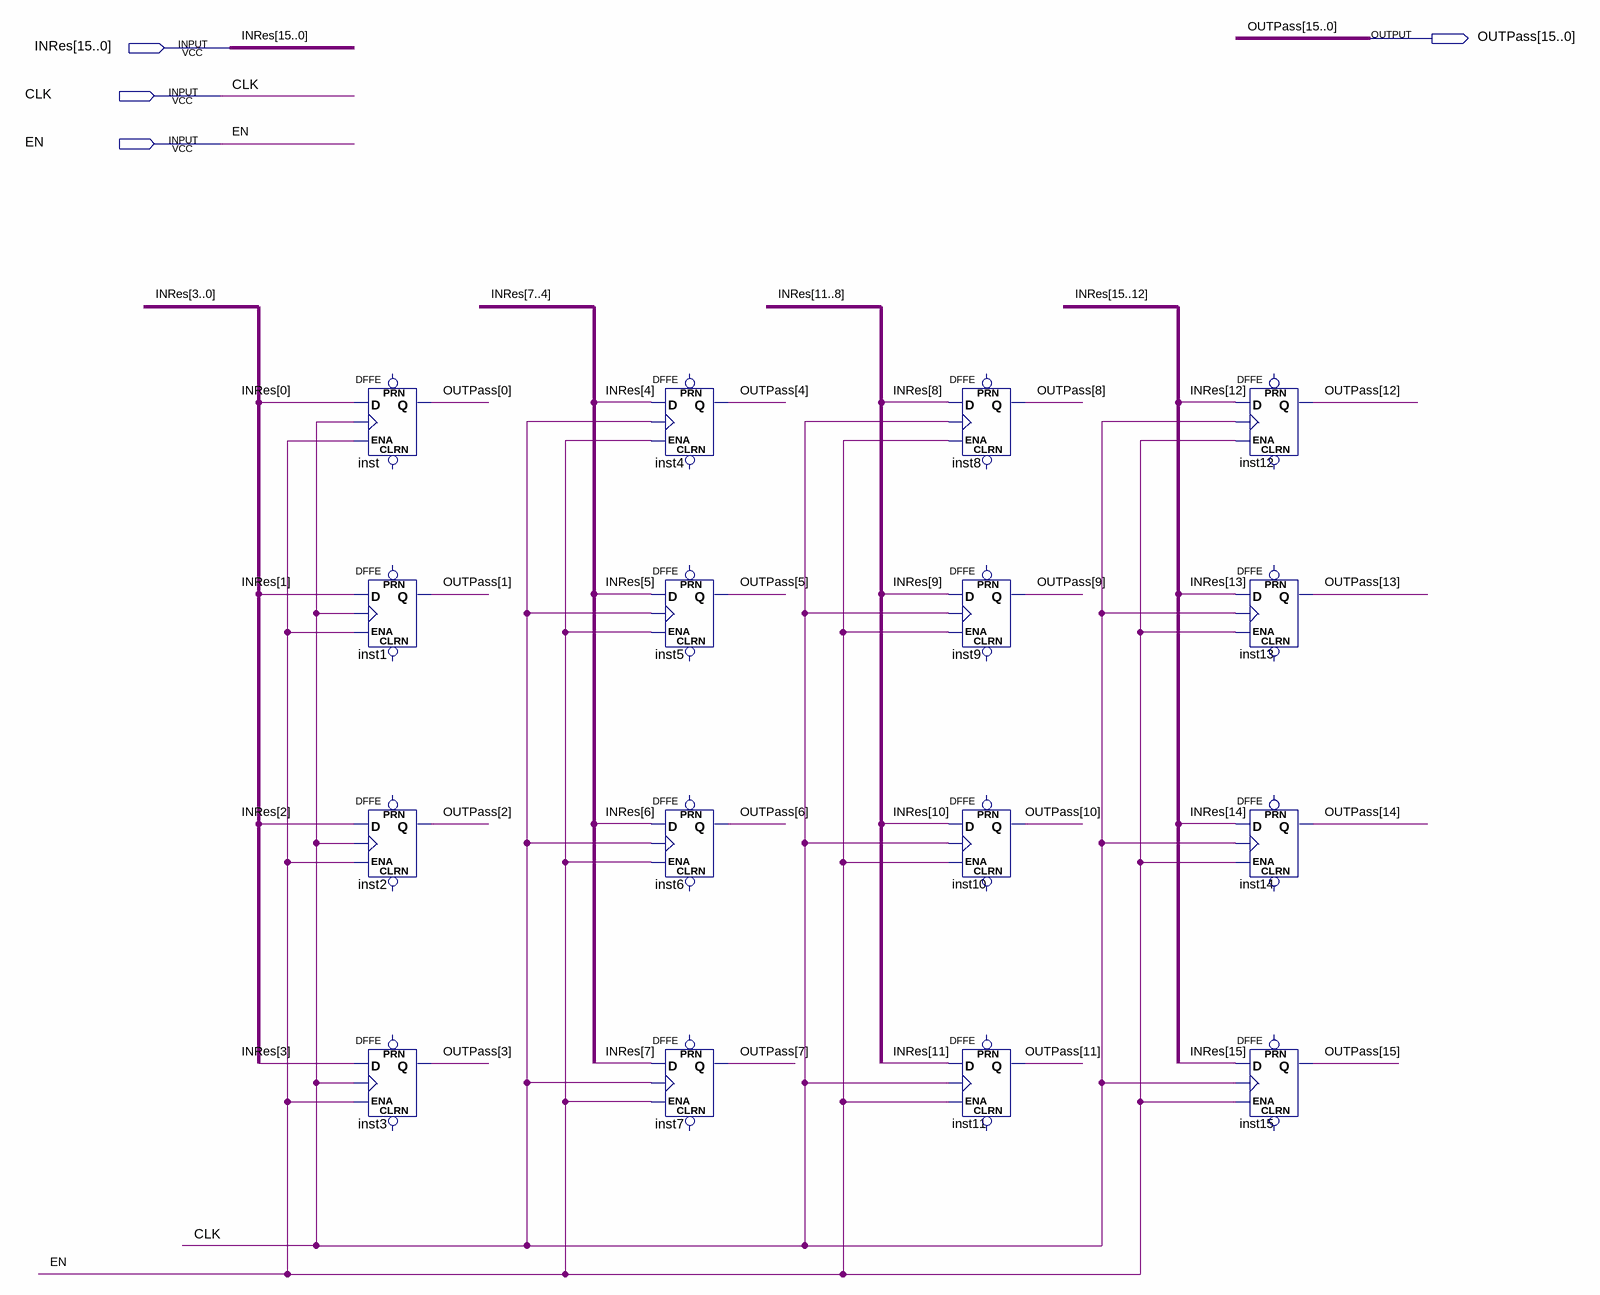
[diagram p0: schematic sheet]
// Quartus schematic angoRegister.bdf as structural Verilog: 16 symbols, 4 pins
module angoRegister (
  input  [15:0] INRes,
  input  CLK,
  input  EN,
  output [15:0] OUTPass
);

  DFFE inst (.D(INRes[0]), .CLK(CLK), .ENA(EN), .Q(OUTPass[0]));  // open: PRN, CLRN
  DFFE inst1 (.D(INRes[1]), .CLK(CLK), .ENA(EN), .Q(OUTPass[1]));  // open: PRN, CLRN
  DFFE inst2 (.D(INRes[2]), .CLK(CLK), .ENA(EN), .Q(OUTPass[2]));  // open: PRN, CLRN
  DFFE inst3 (.D(INRes[3]), .CLK(CLK), .ENA(EN), .Q(OUTPass[3]));  // open: PRN, CLRN
  DFFE inst4 (.D(INRes[4]), .CLK(CLK), .ENA(EN), .Q(OUTPass[4]));  // open: PRN, CLRN
  DFFE inst5 (.D(INRes[5]), .CLK(CLK), .ENA(EN), .Q(OUTPass[5]));  // open: PRN, CLRN
  DFFE inst6 (.D(INRes[6]), .CLK(CLK), .ENA(EN), .Q(OUTPass[6]));  // open: PRN, CLRN
  DFFE inst7 (.D(INRes[7]), .CLK(CLK), .ENA(EN), .Q(OUTPass[7]));  // open: PRN, CLRN
  DFFE inst8 (.D(INRes[8]), .CLK(CLK), .ENA(EN), .Q(OUTPass[8]));  // open: PRN, CLRN
  DFFE inst9 (.D(INRes[9]), .CLK(CLK), .ENA(EN), .Q(OUTPass[9]));  // open: PRN, CLRN
  DFFE inst10 (.D(INRes[10]), .CLK(CLK), .ENA(EN), .Q(OUTPass[10]));  // open: PRN, CLRN
  DFFE inst11 (.D(INRes[11]), .CLK(CLK), .ENA(EN), .Q(OUTPass[11]));  // open: PRN, CLRN
  DFFE inst12 (.D(INRes[12]), .CLK(CLK), .ENA(EN), .Q(OUTPass[12]));  // open: PRN, CLRN
  DFFE inst13 (.D(INRes[13]), .CLK(CLK), .ENA(EN), .Q(OUTPass[13]));  // open: PRN, CLRN
  DFFE inst14 (.D(INRes[14]), .CLK(CLK), .ENA(EN), .Q(OUTPass[14]));  // open: PRN, CLRN
  DFFE inst15 (.D(INRes[15]), .CLK(CLK), .ENA(EN), .Q(OUTPass[15]));  // open: PRN, CLRN
endmodule
